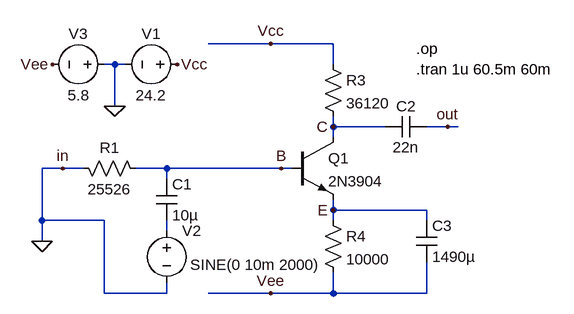
[diagram p0: schematic 3resistor.asc]
3resistor.asc, the LTspice schematic file:
Version 4
SHEET 1 880 680
WIRE 176 80 80 80
WIRE 272 80 176 80
WIRE -64 112 -80 112
WIRE -48 112 -64 112
WIRE 272 112 272 80
WIRE -64 176 -64 112
WIRE 272 208 272 192
WIRE 352 208 272 208
WIRE 448 208 416 208
WIRE 464 208 448 208
WIRE 272 224 272 208
WIRE -144 272 -176 272
WIRE -112 272 -144 272
WIRE 16 272 -32 272
WIRE 192 272 16 272
WIRE 208 272 192 272
WIRE 16 288 16 272
WIRE 272 336 272 320
WIRE 416 336 272 336
WIRE -176 352 -176 272
WIRE -80 352 -176 352
WIRE 272 352 272 336
WIRE 416 352 416 336
WIRE 16 368 16 352
WIRE -176 384 -176 352
WIRE -80 464 -80 352
WIRE 16 464 16 448
WIRE 16 464 -80 464
WIRE 176 464 80 464
WIRE 272 464 272 432
WIRE 272 464 176 464
WIRE 416 464 416 416
WIRE 416 464 272 464
FLAG -64 176 0
FLAG 32 112 Vcc
FLAG 176 80 Vcc
FLAG 192 272 B
FLAG 272 336 E
FLAG 272 208 C
FLAG -176 384 0
FLAG 448 208 out
FLAG -144 272 in
FLAG -160 112 Vee
FLAG 176 464 Vee
DATAFLAG 112 272 "$"
DATAFLAG 352 336 "$"
DATAFLAG 320 208 "$"
SYMBOL voltage 48 112 R90
WINDOW 0 -32 56 VBottom 2
WINDOW 3 32 56 VTop 2
SYMATTR InstName V1
SYMATTR Value 24.2
SYMBOL Res 256 96 R0
SYMATTR InstName R3
SYMATTR Value 36120
SYMBOL Res 256 336 R0
SYMATTR InstName R4
SYMATTR Value 10000
SYMBOL npn 208 224 R0
SYMATTR InstName Q1
SYMATTR Value 2N3904
SYMBOL voltage 16 352 R0
WINDOW 3 36 68 Left 2
SYMATTR InstName V2
SYMATTR Value SINE(0 10m 2000)
SYMBOL Cap 352 224 R270
WINDOW 0 32 32 VTop 2
WINDOW 3 0 32 VBottom 2
SYMATTR InstName C2
SYMATTR Value 22n
SYMBOL Cap 400 352 R0
SYMATTR InstName C3
SYMATTR Value 1490µ
SYMBOL Res -128 256 M90
WINDOW 0 0 56 VBottom 2
WINDOW 3 32 56 VTop 2
SYMATTR InstName R1
SYMATTR Value 25526
SYMBOL voltage -64 112 R90
WINDOW 0 -32 56 VBottom 2
WINDOW 3 32 56 VTop 2
SYMATTR InstName V3
SYMATTR Value 5.8
SYMBOL Cap 0 288 R0
SYMATTR InstName C1
SYMATTR Value 10µ
TEXT 400 88 Left 2 !.op\n.tran 1u 60.5m 60m

The netlist it stands for:
* 3resistor.asc
V1 Vcc 0 24.2
R3 Vcc C 36120
R4 E Vee 10000
Q1 C B E 0 2N3904
V2 N001 0 SINE(0 10m 2000)
C2 C out 22n
C3 E Vee 1490µ
R1 0 B 25526
V3 0 Vee 5.8
C1 B N001 10µ
.model NPN NPN
.model PNP PNP
.lib standard.bjt
.op
.tran 1u 60.5m 60m
.backanno
.end